# Altium schematic sheet LTC1473.SchDoc
size A4
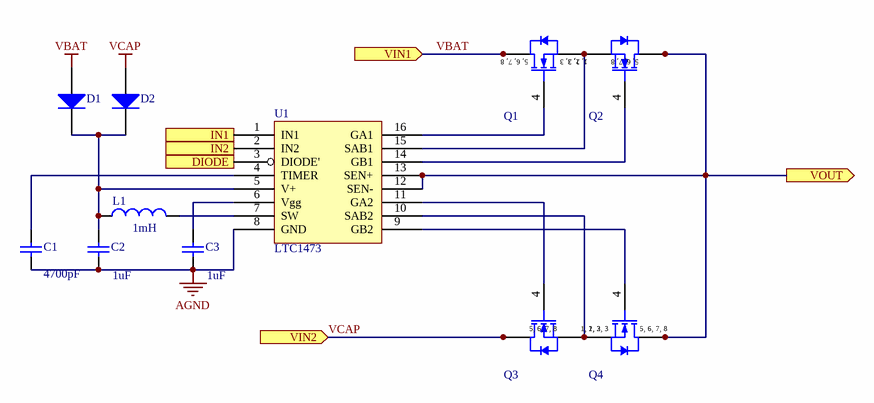
[diagram p0: LTC1473.SchDoc]

## Parts
C1  value 4700pF  [C 0603_L]  (hidden comment: Cap)
C2  value 1uF  [C 0603_L]  (hidden comment: Cap)
C3  value 1uF  [C 0603_L]  (hidden comment: Cap)
D1  Diode  [SOD-523]  (value not drawn)
D2  Diode  [SOD-523]  (value not drawn)
L1  value 1mH  [1812LS-105XKBC]  (hidden comment: Inductor)
Q1  BSC028N06NS G  [INF-PG-TDSON-8-1_V]  (value not drawn)
Q2  BSC028N06NS G  [INF-PG-TDSON-8-1_V]  (value not drawn)
Q3  BSC028N06NS G  [INF-PG-TDSON-8-1_V]  (value not drawn)
Q4  BSC028N06NS G  [INF-PG-TDSON-8-1_V]  (value not drawn)
U1  LTC1473  [SSOP16_N]

## Ports
DIODE (in), IN1 (in), IN2 (in), VIN1 (in), VIN2 (in), VOUT (out)

## Nets
AGND: C1.1 C2.1 C3.1 U1.8(GND)
VBAT: D1.1(A) Q1.5(DRAIN) Q1.6(DRAIN) Q1.7(DRAIN) Q1.8(DRAIN) ; port VIN1
VCAP: D2.1(A) Q3.5(DRAIN) Q3.6(DRAIN) Q3.7(DRAIN) Q3.8(DRAIN) ; port VIN2
DIODE: U1.3(DIODE') ; port DIODE
IN1: U1.1(IN1) ; port IN1
IN2: U1.2(IN2) ; port IN2
VOUT: Q2.5(DRAIN) Q2.6(DRAIN) Q2.7(DRAIN) Q2.8(DRAIN) Q4.5(DRAIN) Q4.6(DRAIN) Q4.7(DRAIN) Q4.8(DRAIN) U1.12(SEN-) U1.13(SEN+) ; port VOUT
NetC1_2: C1.2 U1.4(TIMER)
NetC2_2: C2.2 D1.2(K) D2.2(K) L1.1 U1.5(V+)
NetC3_2: C3.2 U1.6(Vgg)
NetL1_2: L1.2 U1.7(SW)
NetQ1_1: Q1.1(SOURCE) Q1.2(SOURCE) Q1.3(SOURCE) Q2.1(SOURCE) Q2.2(SOURCE) Q2.3(SOURCE) U1.15(SAB1)
NetQ1_4: Q1.4(GATE) U1.16(GA1)
NetQ2_4: Q2.4(GATE) U1.14(GB1)
NetQ3_1: Q3.1(SOURCE) Q3.2(SOURCE) Q3.3(SOURCE) Q4.1(SOURCE) Q4.2(SOURCE) Q4.3(SOURCE) U1.10(SAB2)
NetQ3_4: Q3.4(GATE) U1.11(GA2)
NetQ4_4: Q4.4(GATE) U1.9(GB2)

## Notes on the sheet
- (in symbol BSC118N10NS G) 5, 6, 7, 8; 1, 2, 3

## Library data of the parts
C1-C3 = Cap: X5R 50V; Published: 8-Jun-2000; LatestRevisionDate: 17-Jul-2002; LatestRevisionNote: Re-released for DXP Platform.; PackageReference: RAD-0.3; Publisher: Altium Limited; PackageDescription: Radial Cap, Thru-Hole; 2 Leads; 0.3 in Pin Spacing
D1 D2 = Diode: SS14; Published: 8-Jun-2000; LatestRevisionDate: 17-Jul-2002; LatestRevisionNote: Re-released for DXP Platform.; PackageVersion: Sep-1996; PackageReference: SMC; Publisher: Altium Limited; PackageDescription: DO-214-AB/SMC; 2 C-Bend Leads; Body 7.9 x 5.9 mm, inc. leads (LxW); Code_JEDEC: DO-214-AB
L1 = Inductor: 1812LS-105XKBC; Code_IEC: 1005; Published: 8-Jun-2000; LatestRevisionDate: 29-May-2009; LatestRevisionNote: IPC-7351 Footprint Added.; PackageReference: 0402-A; Publisher: Altium Limited; PackageDescription: Chip Inductor; Code_JEITA: 0402
Q1-Q4 = BSC118N10NS G: N-Channel OptiMOS 2 Power-Transistor, 100 V VDS, 71 A ID, -55 to 150 degC , PG-TDSON-8-1, Reel, Green; Manufacturer: Infineon; Green: TRUE; ID (max): 71 A; IDpuls (max): 280 A; Polarity: N; Ptot (max): 114 W; QG: 42 nC; RDS (on) (max): 11.8 mOhm; Rth: 1.1 K/W; RthJA (max): 62 K/W; VDS (max): 100 V; VGS(th) (max): 4 V; VGS(th) (min): 2 V; DatasheetVersion: Rev. 1.08; PackageReference: PG-TDSON-8-1; PackageDescription: 8-Pin Plastic (Green) Thin Dual Small Outline Non-Leaded Package, 5.15 x 5.9 mm Body, 1.27 mm Pitch; Supplier 1: Mouser; Supplier Part Number 1: 726-BSC118N10NSG; Supplier 2: Digi-Key; Supplier Part Number 2: BSC118N10NS G-ND; Halogen-free: TRUE; Packing: Reel; RthJC (max): 1.1 K/W; Mounting Technology: Surface Mount; PartNumber: BSC118N10NS G; ComponentLink1Description: Manufacturer URL; ComponentLink1URL: http://www.infineon.com/; ComponentLink2Description: Datasheet; ComponentLink2URL: http://www.infineon.com/dgdl/BSC118N10NS+Rev18_pdf.pdf?folderId=db3a3043156fd5730115c7d50620107c&fileId=db3a3043163797a6011647fdc2d4071c; ComponentLink3Description: Package Specification; ComponentLink3URL: http://www.infineon.com/cms/packages/SMD_-_Surface_Mounted_Devices/P-PG-TDSON/P-PG-TDSON-08-01x_2x_3.html?__locale=en